# Altium schematic sheet Bottom Layer.SchDoc
size A
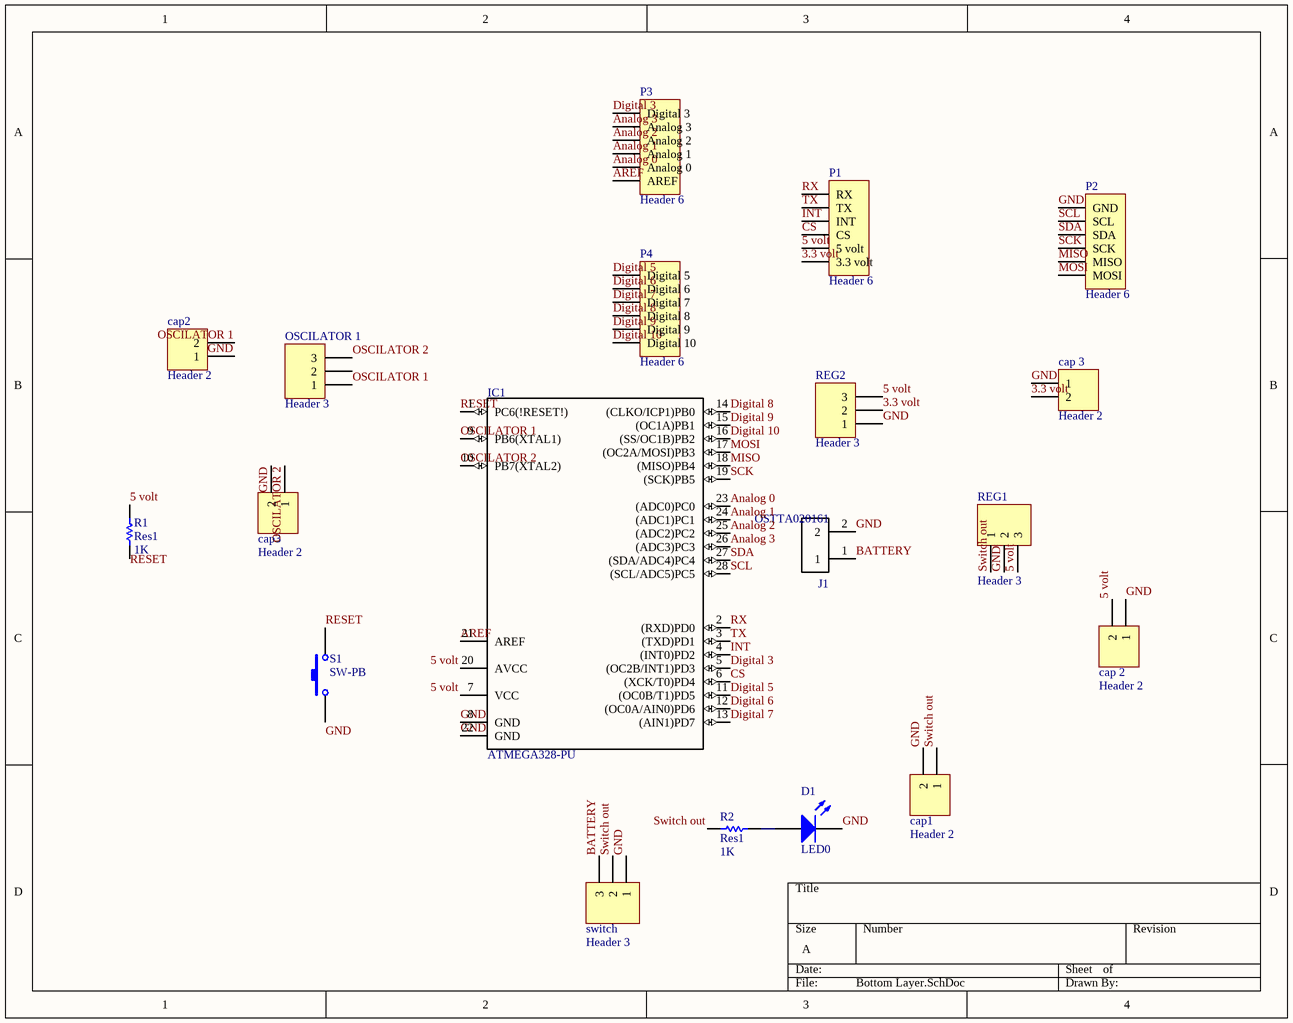
[diagram p0: Bottom Layer.SchDoc]

## Parts
cap1  Header 2  [HDR1X2]
cap2  Header 2  [HDR1X2]
cap3  Header 2  [HDR1X2]
cap_2  Header 2  [HDR1X2]
cap_3  Header 2  [HDR1X2]
D1  LED0  [LED-0]
IC1  ATMEGA328-PU  [*DIL28]
J1  OSTTA020161  [*OST_OSTTA020161]
OSCILATOR_1  Header 3  [HDR1X3]
P1  Header 6  [HDR1X6]
P2  Header 6  [HDR1X6]
P3  Header 6  [HDR1X6]
P4  Header 6  [HDR1X6]
R1  Res1  value 1K  [AXIAL-0.3]
R2  Res1  value 1K  [AXIAL-0.3]
REG1  Header 3  [HDR1X3]
REG2  Header 3  [HDR1X3]
S1  SW-PB  [SPST-2]
switch  Header 3  [HDR1X3]

## Nets
3.3 volt: cap_3.2 P1.6(3.3_volt) REG2.2
5 volt: cap_2.2 IC1.7(VCC) IC1.20(AVCC) P1.5(5_volt) R1.2 REG1.3 REG2.3
Analog 0: IC1.23((ADC0)PC0) P3.5(Analog_0)
Analog 1: IC1.24((ADC1)PC1) P3.4(Analog_1)
Analog 2: IC1.25((ADC2)PC2) P3.3(Analog_2)
Analog 3: IC1.26((ADC3)PC3) P3.2(Analog_3)
AREF: IC1.21(AREF) P3.6(AREF)
BATTERY: J1.1 switch.3
CS: IC1.6((XCK/T0)PD4) P1.4(CS)
Digital 3: IC1.5((OC2B/INT1)PD3) P3.1(Digital_3)
Digital 5: IC1.11((OC0B/T1)PD5) P4.1(Digital_5)
Digital 6: IC1.12((OC0A/AIN0)PD6) P4.2(Digital_6)
Digital 7: IC1.13((AIN1)PD7) P4.3(Digital_7)
Digital 8: IC1.14((CLKO/ICP1)PB0) P4.4(Digital_8)
Digital 9: IC1.15((OC1A)PB1) P4.5(Digital_9)
Digital 10: IC1.16((SS/OC1B)PB2) P4.6(Digital_10)
GND: cap1.2 cap2.1 cap3.2 cap_2.1 cap_3.1 D1.2(K) IC1.8(GND) IC1.22(GND) J1.2 P2.1(GND) REG1.2 REG2.1 S1.1 switch.1
INT: IC1.4((INT0)PD2) P1.3(INT)
MISO: IC1.18((MISO)PB4) P2.5(MISO)
MOSI: IC1.17((OC2A/MOSI)PB3) P2.6(MOSI)
OSCILATOR 1: cap2.2 IC1.9(PB6(XTAL1)) OSCILATOR_1.1
OSCILATOR 2: cap3.1 IC1.10(PB7(XTAL2)) OSCILATOR_1.3
RESET: IC1.1(PC6(!RESET!)) R1.1 S1.2
RX: IC1.2((RXD)PD0) P1.1(RX)
SCK: IC1.19((SCK)PB5) P2.4(SCK)
SCL: IC1.28((SCL/ADC5)PC5) P2.2(SCL)
SDA: IC1.27((SDA/ADC4)PC4) P2.3(SDA)
Switch out: cap1.1 R2.1 REG1.1 switch.2
TX: IC1.3((TXD)PD1) P1.2(TX)
NetD1_1: D1.1(A) R2.2

Not connected (* = marked no-connect by the designer): OSCILATOR_1 2

## Library data of the parts
cap1-cap3 cap_2 cap_3 = Header 2: Header, 2-Pin; LatestRevisionDate: 17-Jul-2002; LatestRevisionNote: Re-released for DXP Platform.; Publisher: Altium Limited
D1 = LED0: Typical INFRARED GaAs LED; Published: 8-Jun-2000; LatestRevisionDate: 08-Jul-2005; LatestRevisionNote: Mech Layer 1 removed.; PackageReference: LED-0; Publisher: Altium Limited; PackageDescription: LED; 2 Leads
IC1 = ATMEGA328-PU: ATmega Series 20 MHz 32 KB Flash 2 KB SRAM 8-Bit Microcontroller - DIP-28; MF: Microchip; Package: PDIP-28 Microchip; Price: None; MP: ATMEGA328-PU; SnapEDA_Link: https://www.snapeda.com/parts/ATMEGA328-PU/Microchip/view-part/?ref=snap; Availability: Unavailable; Value: *
J1 = OSTTA020161: Connector Terminal Blocks 2 Position 5mm Solder Straight Thru-Hole 16A; MF: On Shore; Price: None; Package: None; Availability: Unavailable; SnapEDA_Link: https://www.snapeda.com/parts/OSTTA020161/On%20Shore%20Technology%20Inc./view-part/?ref=snap; MP: OSTTA020161; Value: *
OSCILATOR_1 REG1 REG2 switch = Header 3: Header, 3-Pin; LatestRevisionDate: 17-Jul-2002; LatestRevisionNote: Re-released for DXP Platform.; Publisher: Altium Limited
P1-P4 = Header 6: Header, 6-Pin; LatestRevisionDate: 17-Jul-2002; LatestRevisionNote: Re-released for DXP Platform.; Publisher: Altium Limited
R1 R2 = Res1: Resistor; Published: 8-Jun-2000; LatestRevisionDate: 17-Jul-2002; LatestRevisionNote: Re-released for DXP Platform.; PackageReference: AXIAL-0.3; Publisher: Altium Limited; PackageDescription: Axial Device, Thru-Hole; 2 Leads; 0.3 in Pin Spacing
S1 = SW-PB: Switch; Published: 24-Mar-1999; LatestRevisionDate: 17-Jul-2002; LatestRevisionNote: Re-released for DXP Platform.; PackageReference: SPST-2; Publisher: Altium Limited; PackageDescription: Switch; 2 Leads